# EAGLE schematic schema_electrica_statie_monitorizare (EAGLE 9.6.2)
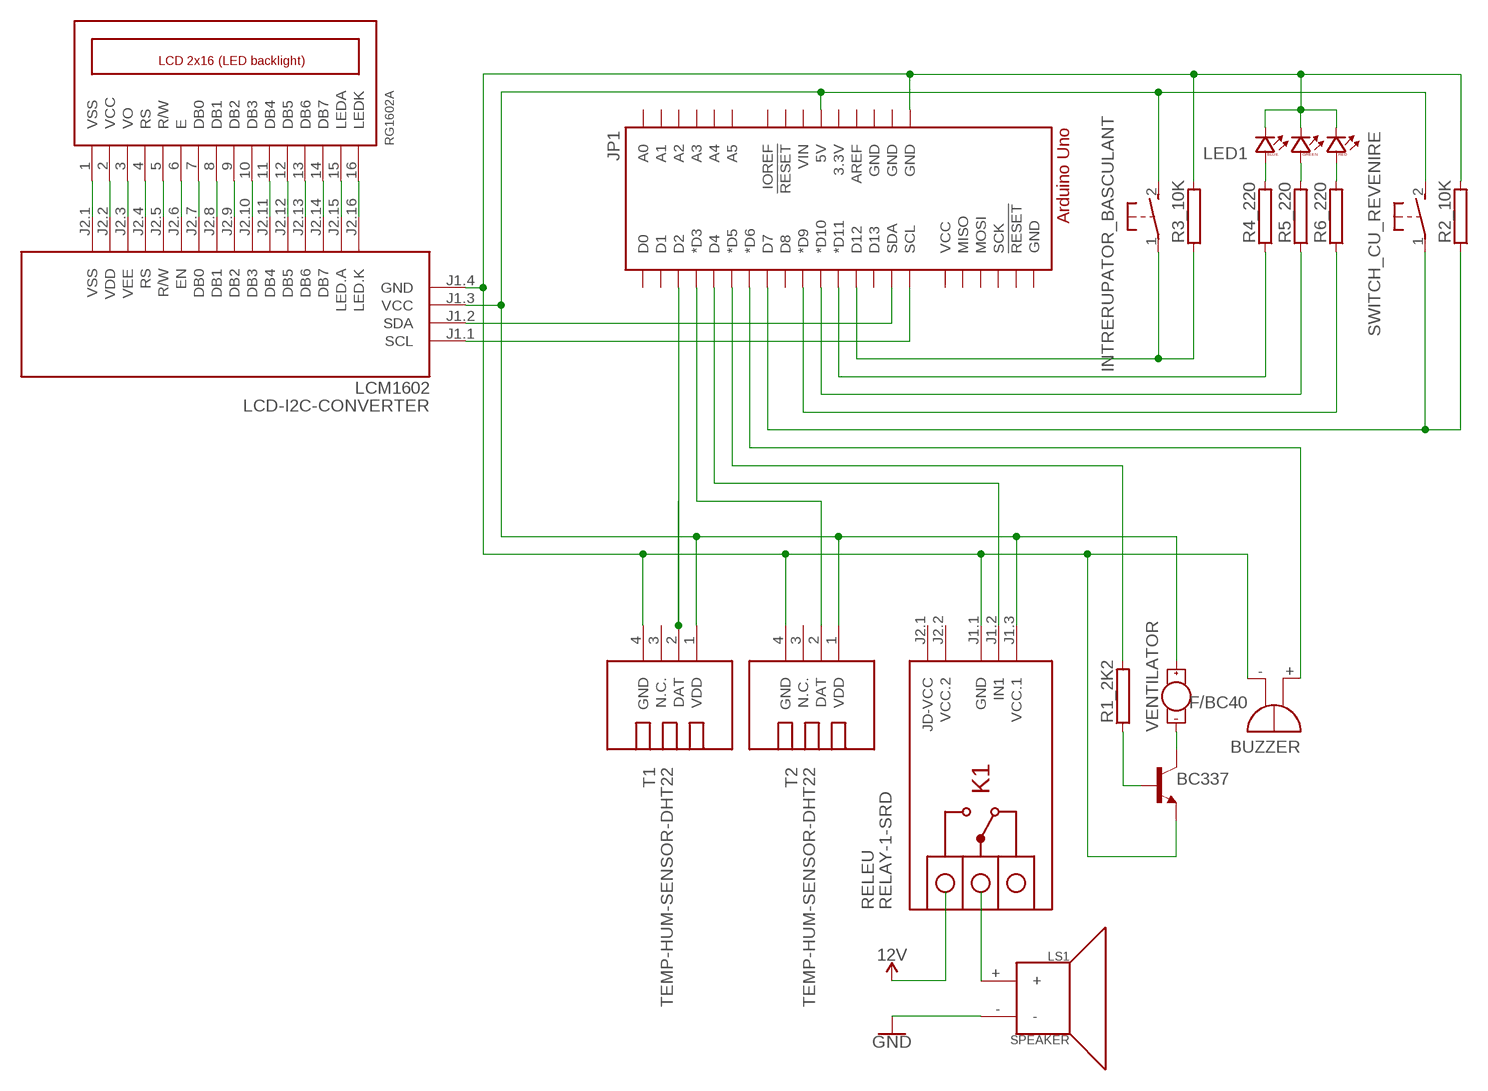
[diagram p0: schematic, sheet 1]

## Parts
BUZZER  F/BC40  [F/BC40]
INTRERUPATOR_BASCULANT  31-XX  [B3F-31XX]
JP1  ARDUINO_R3  [ARDUINO_R3]
LCM1602  LCD-I2C-CONVERTER  [LCD-I2C-CONVERTER]
LED1  F50360  [F50360]
LS1  SPEAKER  [PCB_MOUNT_SPEAKER]
R1_2K2  RAC01  [AC01]
R2_10K  RAC01  [AC01]
R3_10K  RAC01  [AC01]
R4_220  RAC01  [AC01]
R5_220  RAC01  [AC01]
R6_220  RAC01  [AC01]
RELEU  RELAY-1-SRD  [RELAY-1-SRD]
RG1602A  LCD_2X16_SIL  [HY-1602F]
SWITCH_CU_REVENIRE  31-XX  [B3F-31XX]
T1  TEMP-HUM-SENSOR-DHT22  [TEMP-HUM-SENSOR-DHT22]
T2  TEMP-HUM-SENSOR-DHT22  [TEMP-HUM-SENSOR-DHT22]
T3  BC337  [TO92]
VENTILATOR  MOTOR10MM  [VIBE-MOTOR-10MM]

## Nets
GND: LS1.-
N$1: LCM1602.J2.1(VSS) RG1602A.1(VSS)
N$2: LCM1602.J2.2(VDD) RG1602A.2(VCC)
N$3: LCM1602.J2.3(VEE) RG1602A.3(VO)
N$4: LCM1602.J2.4(RS) RG1602A.4(RS)
N$5: LCM1602.J2.5(R/W) RG1602A.5(R/W)
N$6: LCM1602.J2.6(EN) RG1602A.6(E)
N$7: LCM1602.J2.7(DB0) RG1602A.7(DB0)
N$8: LCM1602.J2.8(DB1) RG1602A.8(DB1)
N$9: LCM1602.J2.9(DB2) RG1602A.9(DB2)
N$10: LCM1602.J2.10(DB3) RG1602A.10(DB3)
N$11: LCM1602.J2.11(DB4) RG1602A.11(DB4)
N$12: LCM1602.J2.12(DB5) RG1602A.12(DB5)
N$13: LCM1602.J2.13(DB6) RG1602A.13(DB6)
N$14: LCM1602.J2.14(DB7) RG1602A.14(DB7)
N$15: LCM1602.J2.15(LED.A) RG1602A.15(LEDA)
N$16: LCM1602.J2.16(LED.K) RG1602A.16(LEDK)
N$17: JP1.D2 T1.2(DAT)
N$18: JP1.D3(*D3) T2.2(DAT)
N$19: BUZZER.- JP1.GND@2(GND) LCM1602.J1.4(GND) LED1.BC LED1.GC LED1.RC R2_10K.2 R3_10K.2 RELEU.J1.1(GND) T1.4(GND) T2.4(GND) T3.1(E)
N$20: JP1.SDA LCM1602.J1.2(SDA)
N$21: JP1.SCL LCM1602.J1.1(SCL)
N$22: JP1.D4 RELEU.J1.2(IN1)
N$23: INTRERUPATOR_BASCULANT.2(S) JP1.5V LCM1602.J1.3(VCC) RELEU.J1.3(VCC.1) SWITCH_CU_REVENIRE.2(S) T1.1(VDD) T2.1(VDD) VENTILATOR.+
N$24: JP1.D5(*D5) R1_2K2.2
N$25: BUZZER.+ JP1.D6(*D6)
N$26: JP1.D11(*D11) R4_220.1
N$27: INTRERUPATOR_BASCULANT.1(P) JP1.D12 R3_10K.1
N$28: JP1.D10(*D10) R5_220.1
N$29: LED1.GA R5_220.2
N$30: JP1.D9(*D9) R6_220.1
N$31: LED1.BA R4_220.2
N$32: LS1.+
N$34: R1_2K2.1 T3.2(B)
N$35: T3.3(C) VENTILATOR.-
N$36: JP1.D7 R2_10K.1 SWITCH_CU_REVENIRE.1(P)
N$37: LED1.RA R6_220.2
Unconnected: JP1.3.3V JP1.A0 JP1.A1 JP1.A2 JP1.A3 JP1.A4 JP1.A5 JP1.AREF JP1.D0 JP1.D1 JP1.D8 JP1.D13 JP1.GND@1(GND) JP1.GND@3(GND) JP1.GND@4(GND) JP1.IOREF JP1.MISO JP1.MOSI JP1.RESET@1(!RESET!) JP1.RESET@2(!RESET!) JP1.SCK JP1.VCC JP1.VIN RELEU.J2.1(JD-VCC) T1.3(N.C.) T2.3(N.C.)

## Power pins joined to a net without a drawn wire
VCC.2: RELEU.J2.2(VCC.2)

## Library data of the parts
BUZZER = buzzer:F/BC40: BUZZER Source: Spoerle; OC_FARNELL: unknown; OC_NEWARK: unknown
INTRERUPATOR_BASCULANT SWITCH_CU_REVENIRE = switch-omron:31-XX: OMRON SWITCH; MPN: B3F-3100; OC_FARNELL: 959704; OC_NEWARK: 36M3582
JP1 = Arduino-Uno-Mega:ARDUINO_R3: Arduino R3 Footprint (w/ SPI header)
LCM1602 = diy-modules:LCD-I2C-CONVERTER: I2C Bus to 4-Bit Parallel LCD Interface with LED backlight driver
LED1 = led:F50360: Full color Z-Power LED RGB P5-II Series Source: http://www.seoulsemicon.co.kr .. F50360.pdf
LS1 = SparkFun-Electromechanical:SPEAKER: Speaker Generic 2-terminal loudspeakers SparkFun Products Speaker - PCB Mount <https://www.sparkfun.com/products/11089> (COM-11089); PROD_ID: COMP-11789; SF_SKU: COM-11089
R1_2K2 R2_10K R3_10K R4_220 R5_220 R6_220 = resistor-power:R: Power Resitor; OC_FARNELL: unknown; OC_NEWARK: unknown
RELEU = diy-modules:RELAY-1-SRD: 1-Channel Relay Module based on SRD-05VDC-SL-C relays Click here to find device on ebay.com <http://www.ebay.com/sch/one+channel+isolated+relay+5v>
RG1602A = lcd_2x16_led_backlight:LCD_2X16_SIL
T1 T2 = diy-modules:TEMP-HUM-SENSOR-DHT22: DHT22 - digital humidity & temperature sensor Also known as: AM2302 AM2302 datasheet available here: http://akizukidenshi.com/download/ds/aosong/AM2302.pdf Click here to find device on ebay.com <http://www.ebay.com/sch/dht22+digital+sensor>
T3 = transistor:BC337: NPN TRANSISTOR
VENTILATOR = SparkFun-Electromechanical:MOTOR: Motor (Single-Phase) Two-terminal, single-phase motors. SparkFun Products Vibration Motor <https://www.sparkfun.com/products/8449> (ROB-08449) Physical dimension and wire connections for this powerful vibration motor. Motor has a self adhesive backing.; PROD_ID: COMP-08572; SF_SKU: ROB-08449